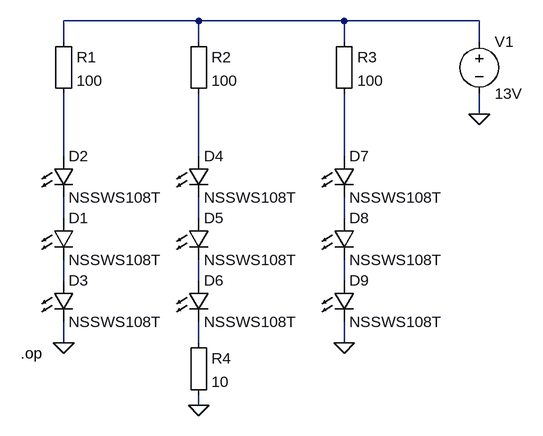
[diagram p0: schematic led current.asc]
led current.asc, the LTspice schematic file:
Version 4
SHEET 1 880 732
WIRE 336 -32 128 -32
WIRE 560 -32 336 -32
WIRE 768 -32 560 -32
WIRE 128 0 128 -32
WIRE 336 0 336 -32
WIRE 560 0 560 -32
WIRE 768 0 768 -32
WIRE 768 112 768 80
WIRE 128 176 128 80
WIRE 336 176 336 80
WIRE 560 176 560 80
WIRE 128 272 128 240
WIRE 336 272 336 240
WIRE 560 272 560 240
WIRE 128 368 128 336
WIRE 336 368 336 336
WIRE 560 368 560 336
WIRE 128 464 128 432
WIRE 336 464 336 432
WIRE 560 464 560 432
WIRE 336 560 336 544
FLAG 128 464 0
FLAG 336 560 0
FLAG 560 464 0
FLAG 768 112 0
SYMBOL Misc\\EuropeanResistor 112 -16 R0
SYMATTR InstName R1
SYMATTR Value 100
SYMBOL Misc\\EuropeanResistor 320 -16 R0
SYMATTR InstName R2
SYMATTR Value 100
SYMBOL LED 112 368 R0
SYMATTR InstName D3
SYMATTR Value NSSWS108T
SYMATTR Description Diode
SYMATTR Type diode
SYMBOL LED 320 368 R0
SYMATTR InstName D6
SYMATTR Value NSSWS108T
SYMATTR Description Diode
SYMATTR Type diode
SYMBOL Misc\\EuropeanResistor 544 -16 R0
SYMATTR InstName R3
SYMATTR Value 100
SYMBOL LED 544 368 R0
SYMATTR InstName D9
SYMATTR Value NSSWS108T
SYMATTR Description Diode
SYMATTR Type diode
SYMBOL voltage 768 -16 R0
WINDOW 123 0 0 Left 0
WINDOW 39 0 0 Left 0
SYMATTR InstName V1
SYMATTR Value 13V
SYMBOL LED 112 272 R0
SYMATTR InstName D1
SYMATTR Value NSSWS108T
SYMATTR Description Diode
SYMATTR Type diode
SYMBOL LED 112 176 R0
SYMATTR InstName D2
SYMATTR Value NSSWS108T
SYMATTR Description Diode
SYMATTR Type diode
SYMBOL LED 320 176 R0
SYMATTR InstName D4
SYMATTR Value NSSWS108T
SYMATTR Description Diode
SYMATTR Type diode
SYMBOL LED 320 272 R0
SYMATTR InstName D5
SYMATTR Value NSSWS108T
SYMATTR Description Diode
SYMATTR Type diode
SYMBOL LED 544 176 R0
SYMATTR InstName D7
SYMATTR Value NSSWS108T
SYMATTR Description Diode
SYMATTR Type diode
SYMBOL LED 544 272 R0
SYMATTR InstName D8
SYMATTR Value NSSWS108T
SYMATTR Description Diode
SYMATTR Type diode
SYMBOL Misc\\EuropeanResistor 320 448 R0
SYMATTR InstName R4
SYMATTR Value 10
TEXT 62 480 Left 2 !.op

The netlist it stands for:
* led current.asc
R1 N001 N002 100
R2 N001 N003 100
D3 N008 0 NSSWS108T
D6 N009 N011 NSSWS108T
R3 N001 N004 100
D9 N010 0 NSSWS108T
V1 N001 0 13V
D1 N005 N008 NSSWS108T
D2 N002 N005 NSSWS108T
D4 N003 N006 NSSWS108T
D5 N006 N009 NSSWS108T
D7 N004 N007 NSSWS108T
D8 N007 N010 NSSWS108T
R4 N011 0 10
.model D D
.lib standard.dio
.op
.backanno
.end